# Altium schematic sheet EPS_RBL.SchDoc: Remove Before Launch
size A4
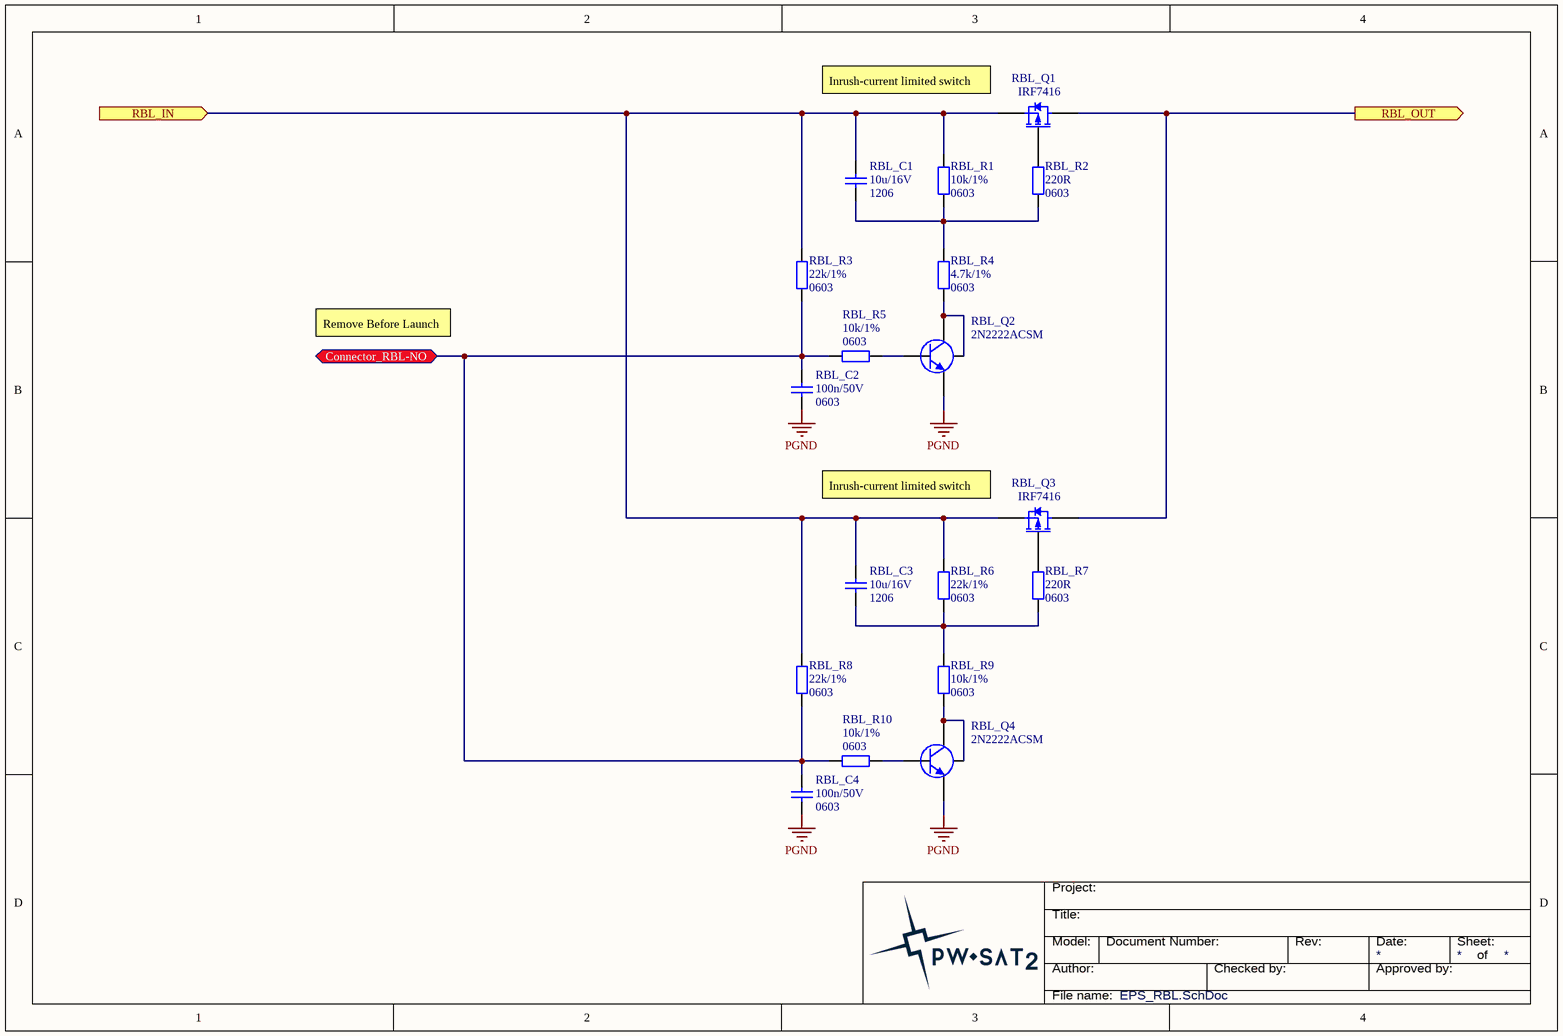
[diagram p0: EPS_RBL.SchDoc]

## Parts
RBL_C1  Packge: 1206  [SMD_Capacitor_1206]  (hidden comment: 10u/16V)
RBL_C2  Package: 0603  [SMD_Capacitor_0603]  (hidden comment: 100n/50V)
RBL_C3  Packge: 1206  [SMD_Capacitor_1206]  (hidden comment: 10u/16V)
RBL_C4  Package: 0603  [SMD_Capacitor_0603]  (hidden comment: 100n/50V)
RBL_Q1  IRF7416  [SOIC-8-N_SSSGDDDD]
RBL_Q2  2N2222ACSM  [LCC1-4_BEC]
RBL_Q3  IRF7416  [SOIC-8-N_SSSGDDDD]
RBL_Q4  2N2222ACSM  [LCC1-4_BEC]
RBL_R1  Package: 0603  [SMD_Resistor_0603]  (hidden comment: 10k/1%)
RBL_R2  Package: 0603  [SMD_Resistor_0603]  (hidden comment: 220R)
RBL_R3  Package: 0603  [SMD_Resistor_0603]  (hidden comment: 22k/1%)
RBL_R4  Package: 0603  [SMD_Resistor_0603]  (hidden comment: 4.7k/1%)
RBL_R5  Package: 0603  [SMD_Resistor_0603]  (hidden comment: 10k/1%)
RBL_R6  Package: 0603  [SMD_Resistor_0603]  (hidden comment: 22k/1%)
RBL_R7  Package: 0603  [SMD_Resistor_0603]  (hidden comment: 220R)
RBL_R8  Package: 0603  [SMD_Resistor_0603]  (hidden comment: 22k/1%)
RBL_R9  Package: 0603  [SMD_Resistor_0603]  (hidden comment: 10k/1%)
RBL_R10  Package: 0603  [SMD_Resistor_0603]  (hidden comment: 10k/1%)

## Ports
Connector_RBL-NO (bidir), RBL_IN (in), RBL_OUT (out)

## Nets
PGND: RBL_C2.2 RBL_C4.2 RBL_Q2.E RBL_Q4.E
Connector_RBL-NO: RBL_C2.1 RBL_C4.1 RBL_R3.2 RBL_R5.1 RBL_R8.2 RBL_R10.1 ; port Connector_RBL-NO
RBL_IN: RBL_C1.1 RBL_C3.1 RBL_Q1.S RBL_Q3.S RBL_R1.1 RBL_R3.1 RBL_R6.1 RBL_R8.1 ; port RBL_IN
RBL_OUT: RBL_Q1.D RBL_Q3.D ; port RBL_OUT
NetRBL_C1_2: RBL_C1.2 RBL_R1.2 RBL_R2.2 RBL_R4.1
NetRBL_C3_2: RBL_C3.2 RBL_R6.2 RBL_R7.2 RBL_R9.1
NetRBL_Q1_G: RBL_Q1.G RBL_R2.1
NetRBL_Q2_B: RBL_Q2.B RBL_R5.2
NetRBL_Q2_C: RBL_Q2.C RBL_Q2.Shield RBL_R4.2
NetRBL_Q3_G: RBL_Q3.G RBL_R7.1
NetRBL_Q4_B: RBL_Q4.B RBL_R10.2
NetRBL_Q4_C: RBL_Q4.C RBL_Q4.Shield RBL_R9.2

## Notes on the sheet
- (near RBL_Q1) Inrush-current limited switch
- Remove Before Launch
- (near RBL_Q3) Inrush-current limited switch
- Title:
- Project:
- Author:
- Model:
- Document Number:
- Checked by:
- Rev:
- Date:
- Approved by:
- Sheet:
- of
- File name:

## Library data of the parts
RBL_C1 RBL_C3 = Cer_C1206T106K4RACTU: Ceramic Cap Kemet COTS 10u/16V X7R 1206; ManufacturerPartNumber: C1206T106K4RACTU; Manufacturer: Kemet; Value: 10u/16V
RBL_C2 RBL_C4 = Cer_GCJ188R71H104KA12D: Ceramic Cap Murata Automotive 100n/50V X7R 0603; Manufacturer: Murata; ManufacturerPartNumber: GCJ188R71H104KA12D; Value: 100n/50V
RBL_Q1 RBL_Q3 = IRF7416: 10A/30V HEXFET Power P-MOSFET.; Manufacturer: International Rectifier; Value: IRF7416
RBL_Q2 RBL_Q4 = 2N2222ACSM: Silicon Planar Epitaxial NPN Transistor.; Manufacturer: Semelab-TT; Value: 2N2222ACSM
RBL_R1-RBL_R10 = Res
  RBL_R1 RBL_R5 RBL_R9 RBL_R10: Value: 10k/1%
  RBL_R2 RBL_R7: Value: 220R
  RBL_R3 RBL_R6 RBL_R8: Value: 22k/1%
  RBL_R4: Value: 4.7k/1%